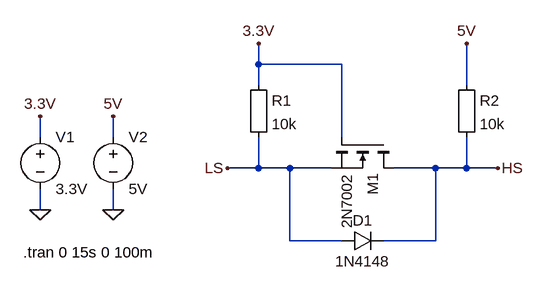
[diagram p0: schematic level-shifter.asc]
level-shifter.asc, the LTspice schematic file:
Version 4
SHEET 1 880 680
WIRE -16 -256 -16 -288
WIRE 112 -256 -16 -256
WIRE -16 -224 -16 -256
WIRE 304 -224 304 -288
WIRE -352 -144 -352 -176
WIRE -240 -144 -240 -176
WIRE 112 -144 112 -256
WIRE -16 -96 -16 -144
WIRE -16 -96 -64 -96
WIRE 32 -96 -16 -96
WIRE 96 -96 32 -96
WIRE 256 -96 192 -96
WIRE 304 -96 304 -144
WIRE 304 -96 256 -96
WIRE 352 -96 304 -96
WIRE -352 -32 -352 -64
WIRE -240 -32 -240 -64
WIRE 32 16 32 -96
WIRE 112 16 32 16
WIRE 256 16 256 -96
WIRE 256 16 176 16
FLAG -64 -96 LS
FLAG 352 -96 HS
FLAG -352 -32 0
FLAG -352 -176 3.3V
FLAG -240 -32 0
FLAG -240 -176 5V
FLAG -16 -288 3.3V
FLAG 304 -288 5V
SYMBOL nmos 192 -144 R90
SYMATTR InstName M1
SYMATTR Value 2N7002
SYMBOL diode 112 32 R270
WINDOW 0 32 32 VTop 2
WINDOW 3 0 32 VBottom 2
SYMATTR InstName D1
SYMATTR Value 1N4148
SYMBOL Misc\\EuropeanResistor -32 -240 R0
SYMATTR InstName R1
SYMATTR Value 10k
SYMBOL Misc\\EuropeanResistor 288 -240 R0
SYMATTR InstName R2
SYMATTR Value 10k
SYMBOL voltage -352 -160 R0
WINDOW 123 0 0 Left 2
WINDOW 39 0 0 Left 2
SYMATTR InstName V1
SYMATTR Value 3.3V
SYMBOL voltage -240 -160 R0
WINDOW 123 0 0 Left 2
WINDOW 39 0 0 Left 2
SYMATTR InstName V2
SYMATTR Value 5V
TEXT -378 34 Left 2 !.tran 0 15s 0 100m

The netlist it stands for:
* level-shifter.asc
M1 HS 3.3V LS LS 2N7002
D1 LS HS 1N4148
R1 3.3V LS 10k
R2 5V HS 10k
V1 3.3V 0 3.3V
V2 5V 0 5V
.model D D
.lib standard.dio
.model NMOS NMOS
.model PMOS PMOS
.lib standard.mos
.tran 0 15s 0 100m
.backanno
.end